# Altium schematic sheet Voltage Regulator and Battery Charger.SchDoc
size A4
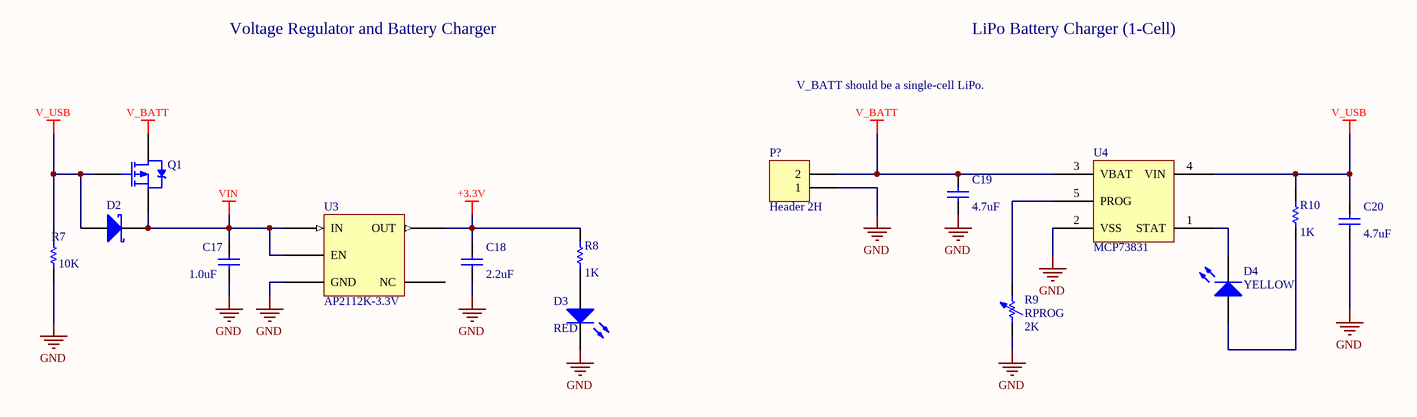
[diagram p0: Voltage Regulator and Battery Charger.SchDoc]

## Parts
C17  value 1.0uF  [RAD-0.3]  (hidden comment: Cap)
C18  value 2.2uF  [RAD-0.3]  (hidden comment: Cap)
C19  value 4.7uF  [RAD-0.3]  (hidden comment: Cap)
C20  value 4.7uF  [RAD-0.3]  (hidden comment: Cap)
D2  D Schottky  [SMB]  (value not drawn)
D3  RED  [3.2X1.6X1.1]
D4  YELLOW  [3.2X1.6X1.1]
P?  Header 2H  [HDR1X2H]
Q1  PMOS-2  [TO-220AB]  (value not drawn)
R7  value 10K  [AXIAL-0.3]  (hidden comment: Res1)
R8  value 1K  [AXIAL-0.3]  (hidden comment: Res1)
R9  RPROG  value 2K  [AXIAL-0.7]
R10  value 1K  [AXIAL-0.3]  (hidden comment: Res1)
U3  AP2112K-3.3V
U4  MCP73831

## Nets
+3.3V: C18.2 R8.2 U3.5(OUT)
GND: C17.1 C18.1 C19.1 C20.1 D3.2(K) P?.1 R7.1 R9.1 U3.2(GND) U4.2(VSS)
V_BATT: C19.2 P?.2 Q1.2(D) U4.3(VBAT)
V_USB: C20.2 D2.1(A) Q1.1(G) R7.2 R10.2 U4.4(VIN)
VIN: C17.2 D2.2(K) Q1.3(S) U3.1(IN) U3.3(EN)
NetD3_1: D3.1(A) R8.1
NetD4_1: D4.1(A) R10.1
NetD4_2: D4.2(K) U4.1(STAT)
NetR9_2: R9.2 U4.5(PROG)

Not connected (* = marked no-connect by the designer): U3 4(NC)

## Notes on the sheet
- Voltage Regulator and Battery Charger
- LiPo Battery Charger (1-Cell)
- V_BATT should be a single-cell LiPo.

## Library data of the parts
C17-C20 = Cap: Capacitor; Published: 8-Jun-2000; LatestRevisionDate: 17-Jul-2002; LatestRevisionNote: Re-released for DXP Platform.; PackageReference: RAD-0.3; Publisher: Altium Limited; PackageDescription: Radial Cap, Thru-Hole; 2 Leads; 0.3 in Pin Spacing
D2 = D Schottky: Schottky Diode; Published: 8-Jun-2000; LatestRevisionDate: 17-Jul-2002; LatestRevisionNote: Re-released for DXP Platform.; PackageReference: SMB; Publisher: Altium Limited; PackageDescription: DO-214-AA/SMB; 2 C-Bend Leads; Body 5.3 x 3.6 mm, inc. leads (LxW); Code_JEDEC: DO-214-AA; Supplier 1: Digi-Key; Supplier Part Number 1: 497-3381-1-ND
D3 D4 = LED2: Typical RED, GREEN, YELLOW, AMBER GaAs LED; Published: 8-Jun-2000; LatestRevisionDate: 17-Jul-2002; LatestRevisionNote: Re-released for DXP Platform.; PackageVersion: Feb-2002; PackageReference: 3.2X1.6X1.1; Publisher: Altium Limited; PackageDescription: SM LED; 2 Flat Leads
P? = Header 2H: Header, 2-Pin, Right Angle; LatestRevisionDate: 17-Jul-2002; LatestRevisionNote: Re-released for DXP Platform.; Publisher: Altium Limited
Q1 = PMOS-2: P-Channel Power MOSFET; Note: Pin 4 not drawn and electrically connected to Pin 2.; Published: 8-Jun-2000; LatestRevisionDate: 17-Jul-2002; LatestRevisionNote: Re-released for DXP Platform.; DatasheetVersion: PD-9.390D; PackageVersion: Feb-1997; PackageReference: TO-220AB; Publisher: Altium Limited; PackageDescription: TO, Thru-Hole, Vertical, Heatsink Mounted; 3 In-Line Leads; Pitch 2.54 mm; ComponentLink1Description: Manufacturer Link; ComponentLink1URL: http://www.irf.com/
R7 R8 R10 = Res1: Resistor; Published: 8-Jun-2000; LatestRevisionDate: 17-Jul-2002; LatestRevisionNote: Re-released for DXP Platform.; PackageReference: AXIAL-0.3; Publisher: Altium Limited; PackageDescription: Axial Device, Thru-Hole; 2 Leads; 0.3 in Pin Spacing
R9 = Res Adj1: Variable Resistor; Set Position: 0.5; Published: 8-Jun-2000; LatestRevisionDate: 17-Jul-2002; LatestRevisionNote: Re-released for DXP Platform.; PackageReference: AXIAL-0.7; Publisher: Altium Limited; PackageDescription: Axial Device, Thru-Hole; 2 Leads; 0.7 in Pin Spacing
U3 = AP2112K-3.3V: 3.3V Regulator; Supplier 1: Digi-Key; Supplier Part Number 1: AP2112K-3.3TRG1DICT-ND
U4 = MCP73831: LiPo Charge Controller